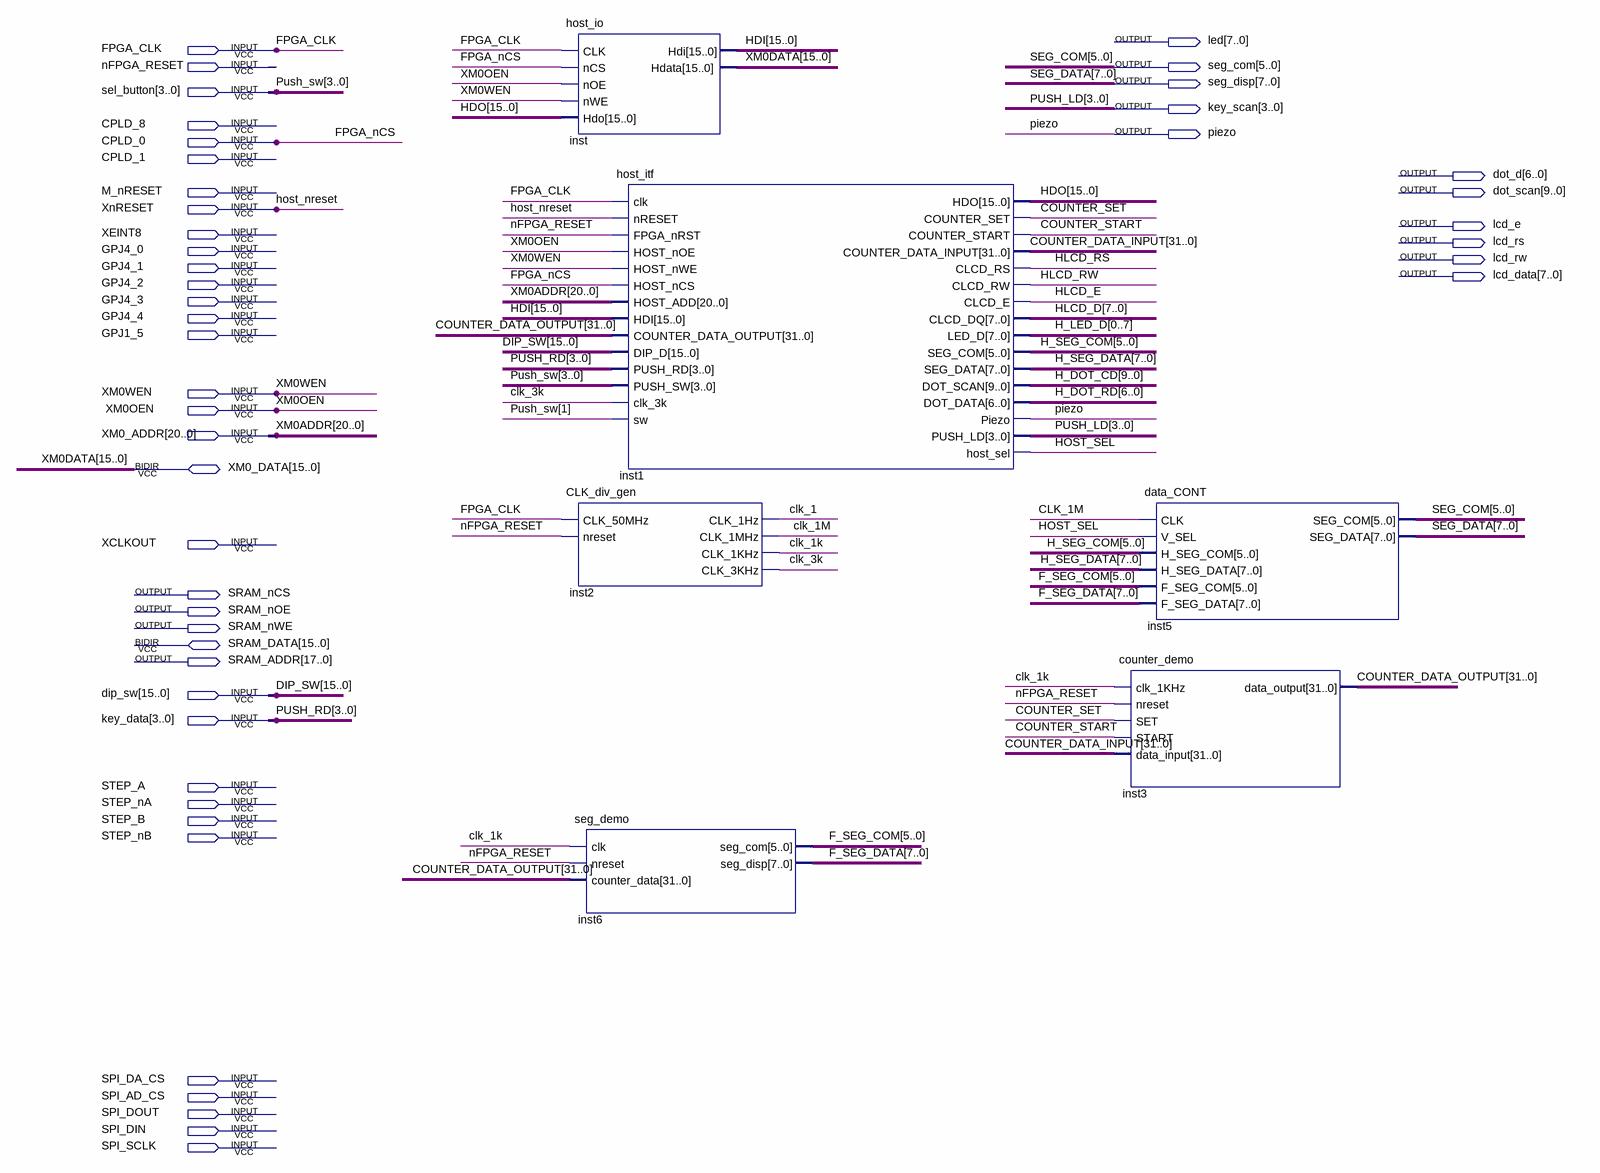
[diagram p0: schematic sheet]
// Quartus schematic M3.bdf as structural Verilog: 6 symbols, 47 pins
module M3 (
  input  FPGA_CLK,
  input  nFPGA_RESET,
  input  [3:0] sel_button,
  input  CPLD_8,
  input  CPLD_0,
  input  CPLD_1,
  input  M_nRESET,
  input  XnRESET,
  input  XEINT8,
  input  GPJ4_0,
  input  GPJ4_1,
  input  GPJ4_2,
  input  GPJ4_3,
  input  GPJ4_4,
  input  GPJ1_5,
  input  XM0WEN,
  input  XM0OEN,
  input  [20:0] XM0_ADDR,
  input  XCLKOUT,
  input  [15:0] dip_sw,
  input  [3:0] key_data,
  input  STEP_A,
  input  STEP_nA,
  input  STEP_B,
  input  STEP_nB,
  input  SPI_DA_CS,
  input  SPI_AD_CS,
  input  SPI_DOUT,
  input  SPI_DIN,
  input  SPI_SCLK,
  inout  [15:0] XM0_DATA,
  inout  [15:0] SRAM_DATA,
  output [7:0] led,
  output [5:0] seg_com,
  output [7:0] seg_disp,
  output [3:0] key_scan,
  output piezo,
  output [6:0] dot_d,
  output [9:0] dot_scan,
  output lcd_e,
  output lcd_rs,
  output lcd_rw,
  output [7:0] lcd_data,
  output SRAM_nCS,
  output SRAM_nOE,
  output SRAM_nWE,
  output [17:0] SRAM_ADDR
);

  wire clk_1, clk_1k, clk_1M, clk_3k, COUNTER_SET, COUNTER_START, HLCD_E, HLCD_RS, HLCD_RW, HOST_SEL;
  wire [5:0] F_SEG_COM, H_SEG_COM;
  wire [6:0] H_DOT_RD;
  wire [7:0] F_SEG_DATA, H_LED_D, H_SEG_DATA, HLCD_D;
  wire [9:0] H_DOT_CD;
  wire [15:0] HDI, HDO;
  wire [31:0] COUNTER_DATA_INPUT, COUNTER_DATA_OUTPUT;

  host_io inst (.CLK(FPGA_CLK), .nCS(CPLD_0), .nOE(XM0OEN), .nWE(XM0WEN), .Hdo(HDO), .Hdi(HDI), .Hdata(XM0_DATA));
  CLK_div_gen inst2 (
    .CLK_50MHz(FPGA_CLK), .nreset(nFPGA_RESET), .CLK_1Hz(clk_1), .CLK_1MHz(clk_1M), .CLK_1KHz(clk_1k),
    .CLK_3KHz(clk_3k));
  seg_demo inst6 (
    .clk(clk_1k), .nreset(nFPGA_RESET), .counter_data(COUNTER_DATA_OUTPUT), .seg_com(F_SEG_COM),
    .seg_disp(F_SEG_DATA));
  host_itf inst1 (
    .clk(FPGA_CLK), .nRESET(XnRESET), .FPGA_nRST(nFPGA_RESET), .HOST_nOE(XM0OEN), .HOST_nWE(XM0WEN),
    .HOST_nCS(CPLD_0), .HOST_ADD(XM0_ADDR), .HDI(HDI), .COUNTER_DATA_OUTPUT(COUNTER_DATA_OUTPUT),
    .DIP_D(dip_sw), .PUSH_RD(key_data), .PUSH_SW(sel_button), .clk_3k(clk_3k), .sw(sel_button[1]), .HDO(HDO),
    .COUNTER_SET(COUNTER_SET), .COUNTER_START(COUNTER_START), .COUNTER_DATA_INPUT(COUNTER_DATA_INPUT),
    .CLCD_RS(HLCD_RS), .CLCD_RW(HLCD_RW), .CLCD_E(HLCD_E), .CLCD_DQ(HLCD_D),
    .LED_D({H_LED_D[0], H_LED_D[1], H_LED_D[2], H_LED_D[3], H_LED_D[4], H_LED_D[5], H_LED_D[6], H_LED_D[7]}),
    .SEG_COM(H_SEG_COM), .SEG_DATA(H_SEG_DATA), .DOT_SCAN(H_DOT_CD), .DOT_DATA(H_DOT_RD), .Piezo(piezo),
    .PUSH_LD(key_scan), .host_sel(HOST_SEL));
  counter_demo inst3 (
    .clk_1KHz(clk_1k), .nreset(nFPGA_RESET), .SET(COUNTER_SET), .START(COUNTER_START),
    .data_input(COUNTER_DATA_INPUT), .data_output(COUNTER_DATA_OUTPUT));
  data_CONT inst5 (
    .CLK(clk_1M), .V_SEL(HOST_SEL), .H_SEG_COM(H_SEG_COM), .H_SEG_DATA(H_SEG_DATA), .F_SEG_COM(F_SEG_COM),
    .F_SEG_DATA(F_SEG_DATA), .SEG_COM(seg_com), .SEG_DATA(seg_disp));

  // Other names for the same wires on the sheet: FPGA_nCS = CPLD_0; PUSH_RD[3:0] = key_data; PUSH_LD[3:0] = key_scan;
  //   SEG_DATA[7:0] = seg_disp; Push_sw[3:0] = sel_button; XM0ADDR[20:0] = XM0_ADDR; XM0DATA[15:0] = XM0_DATA;
  //   host_nreset = XnRESET
endmodule
